# EAGLE design RPi-WD-Packet-Interface - 9pinDSub (EAGLE 7.3.0)
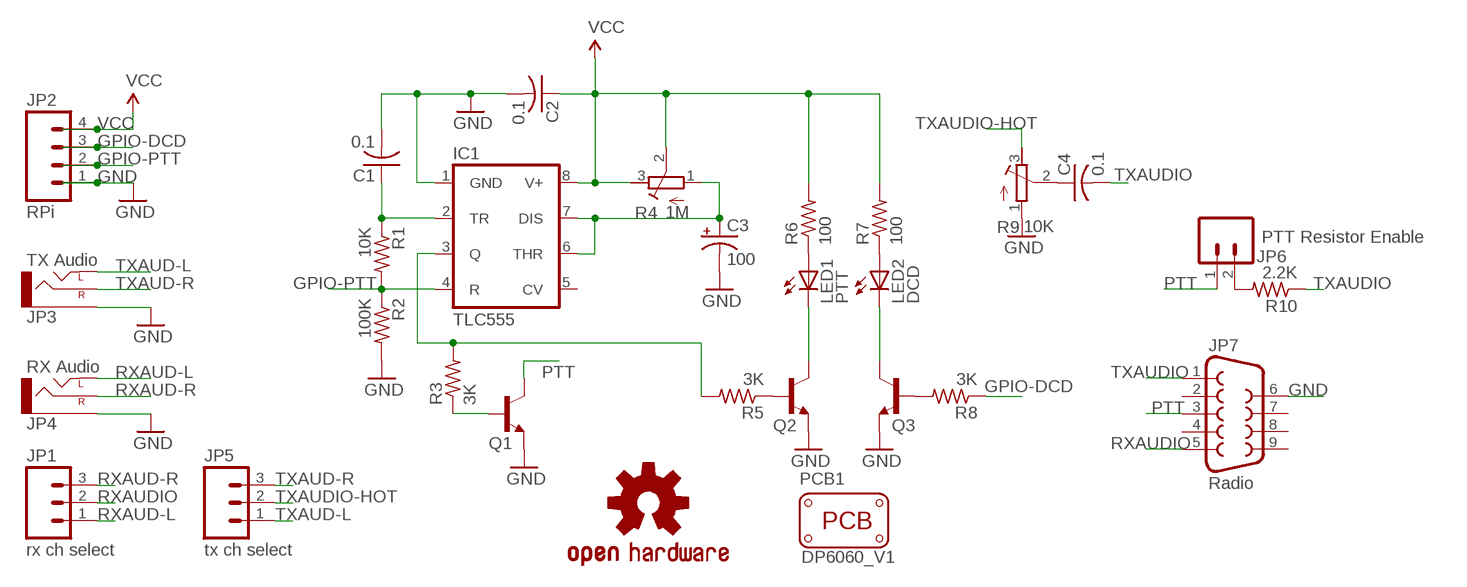
[diagram p0: schematic, sheet 1]

## Parts
C1  0.1  C-US025-025X050  [C025-025X050]
C2  0.1  C-US025-025X050  [C025-025X050]
C3  100  CPOL-USE2-5  [E2-5]
C4  0.1  C-US025-025X050  [C025-025X050]
IC1  TLC555  LM555N  [DIL08]
JP1  rx ch select  M03PTH  [1X03]
JP2  RPi  M04PTH  [1X04]
JP3  TX Audio  AUDIO-JACKPTH  [AUDIO-JACK]
JP4  RX Audio  AUDIO-JACKPTH  [AUDIO-JACK]
JP5  tx ch select  M03PTH  [1X03]
JP6  PTT Resistor Enable  M02PTH  [1X02]
JP7  Radio  DB9FEMALE  [DB9]
LED1  PTT  LED5MM  [LED5MM]
LED2  DCD  LED5MM  [LED5MM]
LOGO1  OSHW-LOGOM  [OSHW-LOGO-M]
PCB1  PCB_DP_SQUARE-6X6  [DP6060_V1]
Q1  PTT  TRANSISTOR_NPNTO-92-AMMO  [TO-92-AMMO]
Q2  PTT-LED  TRANSISTOR_NPNTO-92-AMMO  [TO-92-AMMO]
Q3  DCD-LED  TRANSISTOR_NPNTO-92-AMMO  [TO-92-AMMO]
R1  10K  R-US_0207/7  [0207/7]
R2  100K  R-US_0207/7  [0207/7]
R3  3K  R-US_0207/7  [0207/7]
R4  1M  R-TRIMM3296W  [RTRIM3296W]
R5  3K  R-US_0207/7  [0207/7]
R6  100  R-US_0207/7  [0207/7]
R7  100  R-US_0207/7  [0207/7]
R8  3K  R-US_0207/7  [0207/7]
R9  10K  RTRIM-3362P  [RTRIM3362P]
R10  2.2K  R-US_0207/7  [0207/7]

## Nets
GND: C1.2 C2.2 C3.- IC1.1(GND) JP2.1 JP3.SLEEVE JP4.SLEEVE JP7.6 Q1.1(E) Q2.1(E) Q3.1(E) R2.2 R9.1
GPIO-DCD: JP2.3 R8.1
GPIO-PTT: IC1.4(R) JP2.2 R1.2 R2.1
N$1: LED1.A R6.1
N$2: LED2.A R7.1
N$3: C1.1 IC1.2(TR) R1.1
N$4: C4.1 R9.2
N$5: C3.+ IC1.6(THR) IC1.7(DIS) R4.1(A)
N$6: LED1.K(C) Q2.3(C)
N$7: Q2.2(B) R5.1
N$8: Q1.2(B) R3.1
N$9: LED2.K(C) Q3.3(C)
N$10: Q3.2(B) R8.2
N$11: JP6.2 R10.2
PTT: JP6.1 JP7.3 Q1.3(C)
PTT_TRIGGER: IC1.3(Q) R3.2 R5.2
RXAUD-L: JP1.1 JP4.TIP(LEFT)
RXAUD-R: JP1.3 JP4.RING(RIGHT)
RXAUDIO: JP1.2 JP7.5
TXAUD-L: JP3.TIP(LEFT) JP5.1
TXAUD-R: JP3.RING(RIGHT) JP5.3
TXAUDIO: C4.2 JP7.1 R10.1
TXAUDIO-HOT: JP5.2 R9.3
VCC: C2.1 IC1.8(V+) JP2.4 R4.2(S) R4.3(E) R6.2 R7.2
Unconnected: IC1.5(CV) JP7.2 JP7.4 JP7.7 JP7.8 JP7.9

## Library data of the parts
C1 C2 C4 = rcl:C-US: CAPACITOR, American symbol
C3 = rcl:CPOL-US: POLARIZED CAPACITOR, American symbol
IC1 = linear:*555: TIMER
JP1 JP5 = SparkFun-Connectors:M03: Header 3 Standard 3-pin 0.1" header. Use with straight break away headers (SKU : PRT-00116), right angle break away headers (PRT-00553), swiss pins (PRT-00743), machine pins (PRT-00117), and female headers (PRT-00115). Molex polarized connector foot print use with SKU : PRT-08232 with associated crimp pins and housings.
JP2 = SparkFun-Connectors:M04: Header 4 Standard 4-pin 0.1" header. Use with straight break away headers (SKU : PRT-00116), right angle break away headers (PRT-00553), swiss pins (PRT-00743), machine pins (PRT-00117), and female headers (PRT-00115). Molex polarized connector foot print use with SKU : PRT-08231 with associated crimp pins and housings. 1MM SMD Version SKU: PRT-10208
JP3 JP4 = SparkFun-Connectors:AUDIO-JACK: 3.5mm Audio Jack Simple 3.5mm common PCB mount audio jack. Variant PTH is our storefront SKU PRT-08032
JP6 = SparkFun-Connectors:M02: Standard 2-pin 0.1" header. Use with - straight break away headers ( PRT-00116) - right angle break away headers (PRT-00553) - swiss pins (PRT-00743) - machine pins (PRT-00117) - female headers (PRT-00115) Molex polarized connector foot print use with: PRT-08233 with associated crimp pins and housings. 2.54_SCREWTERM for use with PRT-10571. 3.5mm Screw Terminal footprints for PRT-08084 5mm Screw Terminal footprints for use with PRT-08432
JP7 = SparkFun-Connectors:DB9: DB9 Connector Standard DB9 (D-Sub 9) serial connector. Can be used for CAN bus as well as RS485 and RS232. Footprint production proven. Spark Fun Electronics SKU : PRT-00429; PROD_ID: CONN-08194
LED1 LED2 = led:LED: LED OSRAM: - CHIPLED LG R971, LG N971, LY N971, LG Q971, LY Q971, LO R971, LY R971 LH N974, LH R974 LS Q976, LO Q976, LY Q976 LO Q996 - Hyper CHIPLED LW Q18S LB Q993, LB Q99A, LB R99A - SideLED LS A670, LO A670, LY A670, LG A670, LP A670 LB A673, LV A673, LT A673, LW A673 LH A674 LY A675 LS A676, LA A676, LO A676, LY A676, LW A676 LS A679, LY A679, LG A679 - Hyper Micro SIDELED® LS Y876, LA Y876, LO Y876, LY Y876 LT Y87S - SmartLED LW L88C, LW L88S LB L89C, LB L89S, LG L890 LS L89K, LO L89K, LY L89K LS L896, LA L896, LO L896, LY L896 - TOPLED LS T670, LO T670, LY T670, LG T670, LP T670 LSG T670, LSP T670, LSY T670, LOP T670, LYG T670 LG T671, LOG T671, LSG T671 LB T673, LV T673, LT T673, LW T673 LH T674 LS T676, LA T676, LO T676, LY T676, LB T676, LH T676, LSB T676, LW T676 LB T67C, LV T67C, LT T67C, LS T67K, LO T67K, LY T67K, LW E67C LS E67B, LA E67B, LO E67B, LY E67B, LB E67C, LV E67C, LT E67C LW T67C LS T679, LY T679, LG T679 LS T770, LO T770, LY T770, LG T770, LP T770 LB T773, LV T773, LT T773, LW T773 LH T774 LS E675, LA E675, LY E675, LS T675 LS T776, LA T776, LO T776, LY T776, LB T776 LHGB T686 LT T68C, LB T68C - Hyper Mini TOPLED® LB M676 - Mini TOPLED Santana® LG M470 LS M47K, LO M47K, LY M47K Source: http://www.osram.convergy.de LUXEON: - LUMILED® LXK2-PW12-R00, LXK2-PW12-S00, LXK2-PW14-U00, LXK2-PW14-V00 LXK2-PM12-R00, LXK2-PM12-S00, LXK2-PM14-U00 LXK2-PE12-Q00, LXK2-PE12-R00, LXK2-PE12-S00, LXK2-PE14-T00, LXK2-PE14-U00 LXK2-PB12-K00, LXK2-PB12-L00, LXK2-PB12-M00, LXK2-PB14-N00, LXK2-PB14-P00, LXK2-PB14-Q00 LXK2-PR12-L00, LXK2-PR12-M00, LXK2-PR14-Q00, LXK2-PR14-R00 LXK2-PD12-Q00, LXK2-PD12-R00, LXK2-PD12-S00 LXK2-PH12-R00, LXK2-PH12-S00 LXK2-PL12-P00, LXK2-PL12-Q00, LXK2-PL12-R00 Source: www.luxeon.com KINGBRIGHT: KA-3528ASYC Source: www.kingbright.com
LOGO1 = SparkFun-Aesthetics:OSHW-LOGO: Open Source Hardware Logo This logo indicates the piece of hardware it is found on incorporates a OSHW license and/or adheres to the definition of open source hardware found here: http://freedomdefined.org/OSHW
PCB1 = dp_devices:PCB_DP_SQUARE: Dangerous Prototypes Standard Square PCB sizes; PCB_SIZE: DP6060_V1
Q1-Q3 = SparkFun-DiscreteSemi:TRANSISTOR_NPN: Generic NPN BJT MMBT2222A - TRANS-08049 (SOT-23, 1A 40V) MPSA42 - TRANS-09116 (SOT-23, 500mA 300V) MMBT5088LT1G - TRANS-11160 (SOT-23, 50 mA 30V) BC547 - COM-08928 <http://www.sparkfun.com/products/8928> (TO-92 45V 100mA) (1.Collector 2.Base 3.Emitter) 2N3904 - COM-00521 <http://www.sparkfun.com/products/521> (TO-92 40V 200mA) (1.Emitter 2.Base 3.Collector) P2N2222A - COM-12852 <http://www.sparkfun.com/products/12852> (TO-92 40V 600mA) (1.Collector 2.Base 3.Emitter)
R1-R3 R5-R8 R10 = rcl:R-US_: RESISTOR, American symbol
R4 = rcl:R-TRIMM: Trimm resistor
R9 = GeekAmmo:RTRIM: BOURNS 3362 - 1/4" Square Trimpot® Trimming Potentiometer

## Net classes
0 default: width 0.61 mm, clearance 0.254 mm

## Board
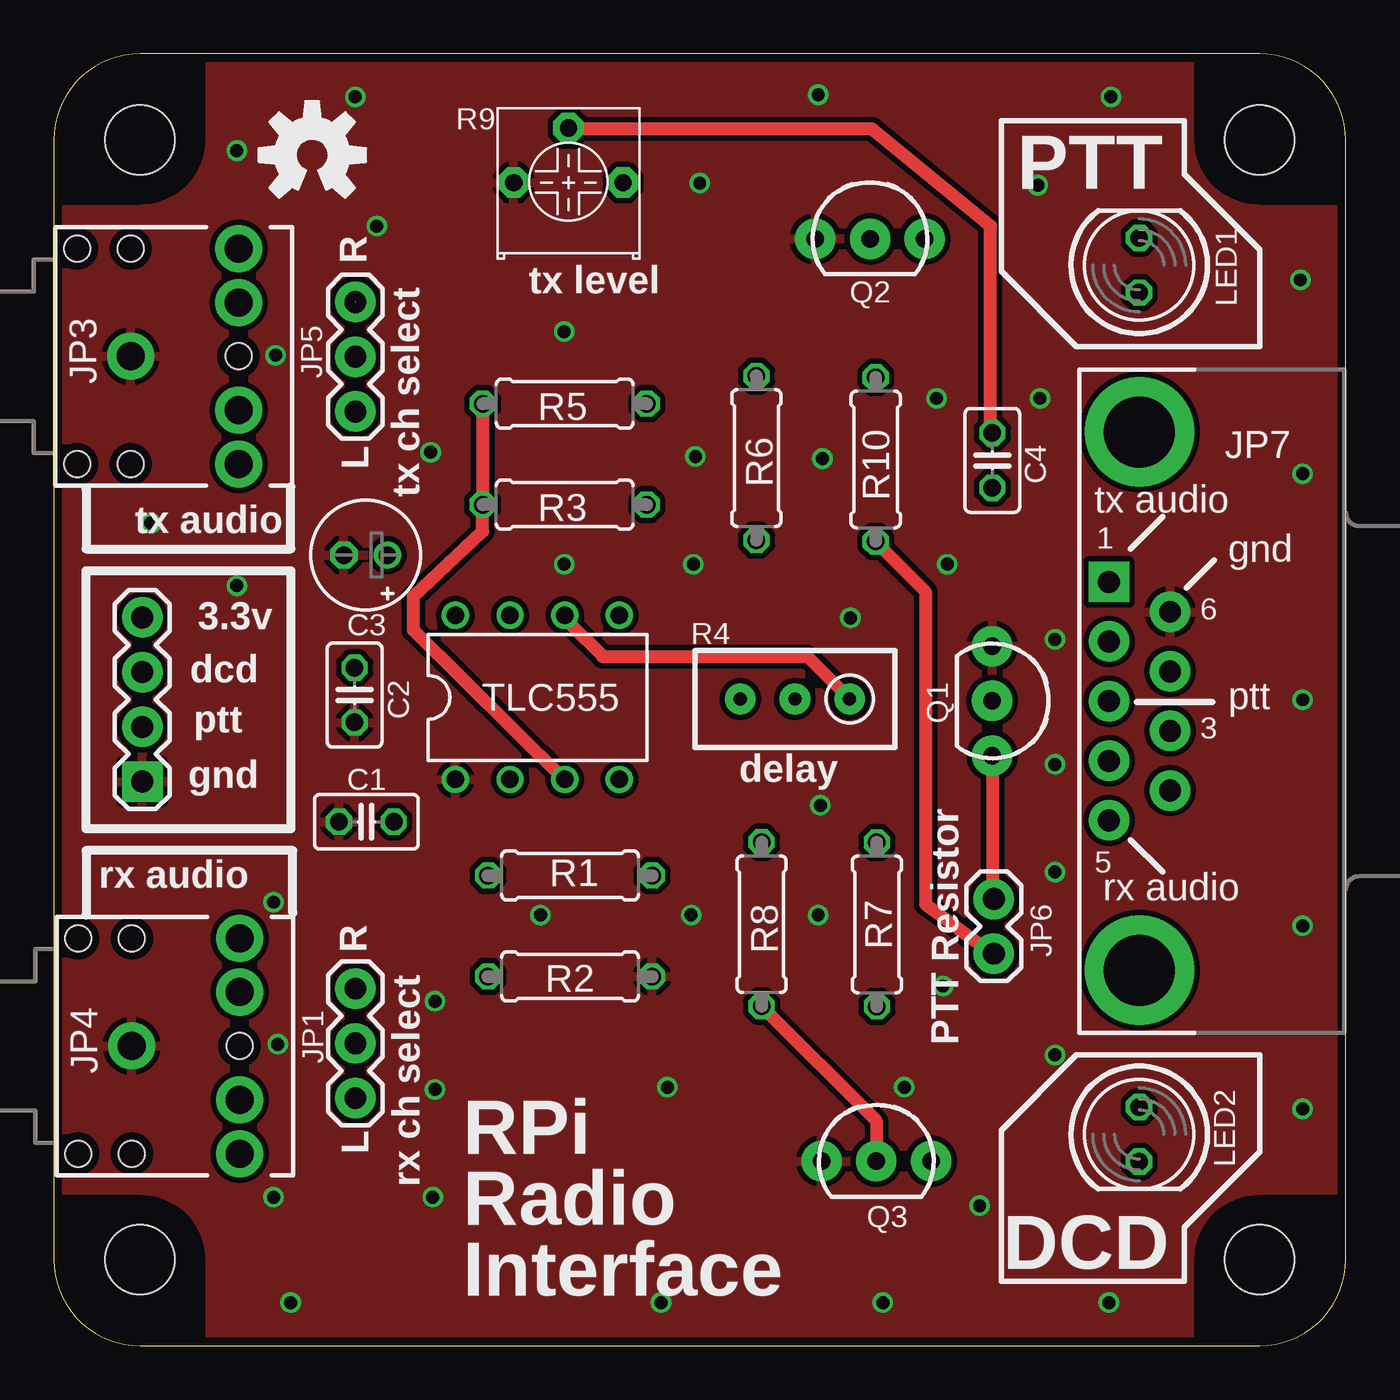
[diagram p1: board, top side]
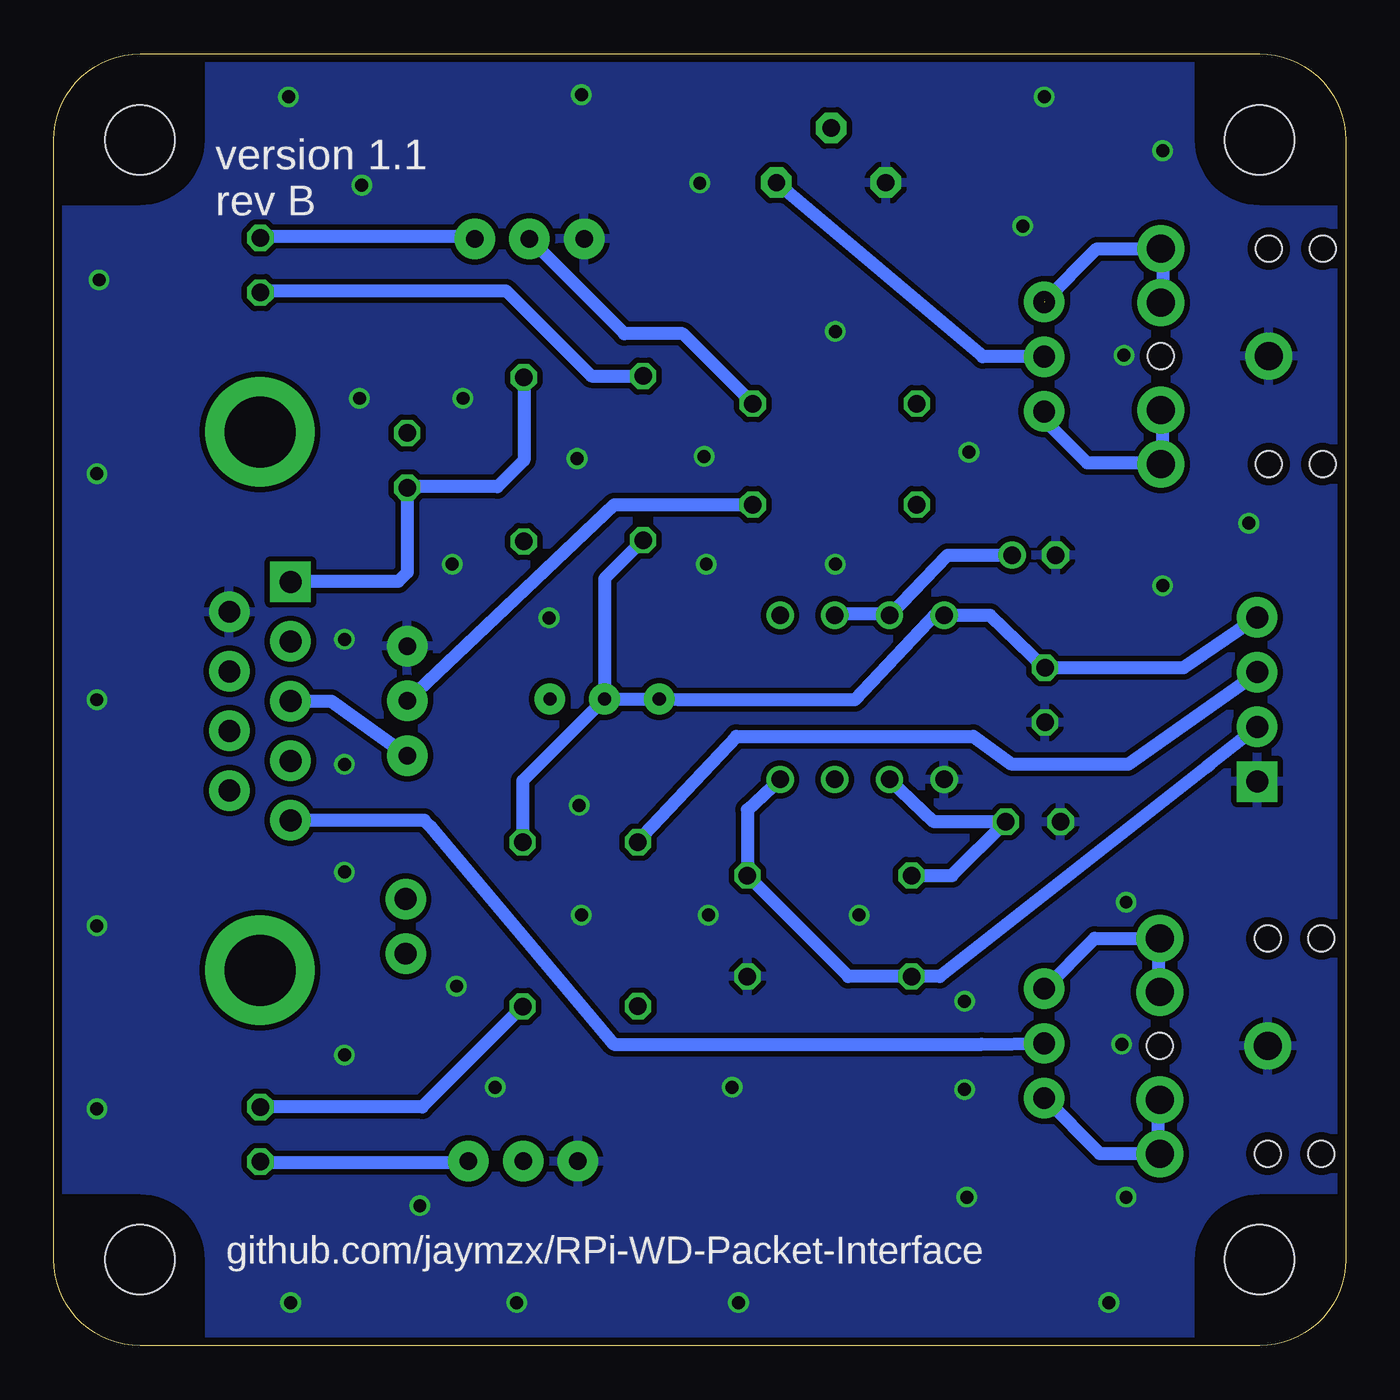
[diagram p2: board, bottom side, seen from below]

Size 60 x 60 mm. Coordinates in mm from the lower left corner, seen from the top.
Copper layers (1*16): Top 0.0356mm / dielectric 1.5011mm / Bottom 0.0356mm
Design rules "OSHParkDesignRules *": minimum track width 6mil, minimum drill 13mil, track to track 6mil, track to pad 6mil, pad to pad 6mil, via to via 6mil, smd to smd 6mil, copper to edge 15mil, drill to drill 6mil, minimum pad ring 7mil, minimum via ring 7mil, stop-mask expansion 3mil, vias tented up to drill 25mm, thermal gap 10mil

### Footprints (pad centres in the part's own frame; a part is rotated, then mirrored left to right if it is on the bottom)
C025-025X050 = drill 0.813 octagon: 1 -1.27,0; 2 1.27,0
E2-5 = drill 0.813 pad 1.27: + -1.016,0 | drill 0.813 pad 1.27 octagon: - 1.016,0
DIL08 = drill 0.813 pad 1.27: 1 -3.81,-3.81; 2 -1.27,-3.81; 3 1.27,-3.81; 4 3.81,-3.81; 5 3.81,3.81; 6 1.27,3.81; 7 -1.27,3.81; 8 -3.81,3.81
1X03 = drill 1.016 pad 1.88: 1 0,0; 2 2.54,0; 3 5.08,0
1X04 = drill 1.016 pad 1.88 square: 1 0,0 | drill 1.016 pad 1.88: 2 2.54,0; 3 5.08,0; 4 7.62,0
AUDIO-JACK = drill 1.3 pad 2.184: RING 5,5; RSH 5,2.5; SLEEVE 0,0; TIP 5,-5; TSH 5,-2.5 | hole 1.2: 0,5; -2.5,5; -2.5,-5; 0,-5; 5,0
1X02 = drill 1.016 pad 1.88: 1 0,0; 2 2.54,0
DB9 = drill 1.016 pad 1.88 square: 1 -5.54,-1.42 | drill 1.016 pad 1.88: 2 -2.77,-1.42; 3 0,-1.42; 4 2.77,-1.42; 5 5.54,-1.42; 6 -4.15,1.42; 7 -1.38,1.42; 8 1.38,1.42; 9 4.15,1.42 | drill 3.302 pad 5.08: G1 -12.5,0; G2 12.5,0
LED5MM = drill 0.813 octagon: A -1.27,0; K 1.27,0
DP6060_V1 = hole 3.2: -26,-26; 26,-26; 26,26; -26,26
TO-92-AMMO = drill 0.813 pad 1.88: 1 -2.54,0; 2 0,0; 3 2.54,0
0207/7 = drill 0.813 octagon: 1 -3.81,0; 2 3.81,0
RTRIM3296W = drill 0.61 pad 1.422: 1 0,-2.54; 2 0,0; 3 0,2.54
RTRIM3362P = drill 0.8 pad 1.422 octagon: 1 -2.54,-2.54; 2 0,0; 3 2.54,-2.54

### Placement (x,y rotation side)
C1  14.52,24.33 180 top
C2  13.97,30.21 270 top
C3  14.48,36.72 180 top
C4  43.59,41.12 270 top
IC1  22.46,30.11 0 top
JP1  14.01,11.5 90 top
JP2  4.11,26.2 90 top
JP3  3.58,45.95 0 top
JP4  3.62,13.92 0 top
JP5  14.01,43.39 90 top
JP6  43.66,20.75 270 top
JP7  50.42,29.93 270 top
LED1  50.41,50.18 90 top
LED2  50.41,9.81 270 top
LOGO1  12,55.3 0 top
PCB1  30,30 0 top
Q1  43.59,29.95 270 top
Q2  37.91,51.41 0 top
Q3  38.2,8.57 0 top
R1  23.98,21.84 0 top
R2  23.98,17.15 0 top
R3  23.73,39.06 180 top
R4  34.42,30.04 90 top
R5  23.73,43.75 180 top
R6  32.63,41.23 270 top
R7  38.23,19.57 90 top
R8  32.87,19.57 270 top
R9  23.9,56.56 0 top
R10  38.17,41.16 270 top

### Tracks (layer width: path | path; a pad name or v marks a point on that pad's centre or on a via)
GND  (via drill 0.6 pad 0.25)
  other vias: 49.1,58 45.7,53.9 35.5,58.1 17.6,6.9 14,58 8.5,55.5 15,52 30,54 57.9,49.5 41,44 17.5,41.5 4.5,38.2 10.3,46 58,40.5 45.8,44 8.5,35.3 46.5,22 58,19.5 35.5,20 41.3,16.7 10.4,14 17.7,11.9 28.5,12 58,11 43,6.5 49,2 38.5,2 28.2,2 11,2 39.5,12 46.5,13.5 58,30 17.7,16 29.6,20 23.7,36.3 35.7,41.2 29.8,41.3 35.6,25.1 23.7,47.1 10.2,20.6 10.2,6.9 22.6,20 41.5,36.3 37,33.8 46.5,27 46.5,32.8 29.7,36.3
  pour Top (isolate 0.012): 0,60 60,60 60,0 0,0
  pour Bottom (isolate 0.012): 0,60 60,60 60,0 0,0
GPIO-DCD
  Bottom 0.61: R8.1 33,23.3 28.3,28.3 17.3,28.3 15.5,27 10.1,27 4.72,30.78 JP2.3
GPIO-PTT
  Bottom 0.61: IC1.4 27.79,24.89 R1.2 23.09,17.15 R2.1 18.85,17.15 6.3,27 6.45,26.9 JP2.2
N$1
  Bottom 0.61: LED1.A 50.32,49 39,49 35.03,45.03 R6.1
N$2
  Bottom 0.61: R7.1 42.9,11.09 LED2.A
N$3
  Bottom 0.61: IC1.2 19.12,24.33 C1.1 18.28,21.84 R1.1
N$4
  Top 0.61: R9.2 24,56.5 38,56.5 43.5,52 43.5,42 C4.1
N$5
  Top 0.61: R4.1 36.5,30.5 35,32 25.5,32 24,33.5 IC1.6
  Bottom 0.254: 21.5,34 IC1.7 | 23.5,34 IC1.6
  Bottom 0.61: 23.5,34 21.5,34 | IC1.7 18.49,36.72 C3.+
N$6
  Bottom 0.254: 40.5,51.5 Q2.3
  Bottom 0.61: 40.5,51.5 50,51.5 LED1.K
N$7
  Bottom 0.61: R5.1 30.79,47 33.5,47 Q2.2
N$8
  Bottom 0.61: R3.1 33.97,39.06 Q1.2
N$9
  Bottom 0.61: LED2.K 50,8.5 41,8.5 Q3.3
N$10
  Top 0.61: R8.2 38.2,10.44 Q3.2
N$11
  Top 0.61: R10.2 40.5,35 40.5,20.5 42.5,19 JP6.2
N$12
  Bottom 0.61: 8.7,19 8.7,16
N$13
  Bottom 0.61: 8.7,9 8.7,11.5
N$14
  Bottom 0.61: 8.5,51 8.5,48.5
N$15
  Bottom 0.61: 8.5,41 8.5,43.5
PTT
  Top 0.254: 43.59,20.82 JP6.1
  Top 0.61: Q1.3 43.59,20.82
  Bottom 0.61: JP7.3 47.12,29.93 Q1.3
PTT_TRIGGER
  Top 0.61: R5.2 R3.2 19.91,37.81 16.7,34.8 16.7,33.23 IC1.3
RXAUD-L
  Bottom 0.61: JP4.TIP 11.43,8.92 JP1.1
RXAUD-R
  Bottom 0.61: JP1.3 11.66,18.92 JP4.RING
RXAUDIO
  Bottom 0.61: JP1.2 16.9,14 34,14 42.5,24.1 42.8,24.4 JP7.5
TXAUD-L
  Bottom 0.61: JP5.1 14,43 12,41 9,41 JP3.TIP
TXAUD-R  (1 unrouted)
  Bottom 0.61: 14,48.5 11.55,50.95 JP3.RING
TXAUDIO
  Bottom 0.61: R10.1 38.17,41.13 39.4,39.9 43.53,39.9 C4.2 43.59,35.91 44,35.5 48.98,35.5 JP7.1
TXAUDIO-HOT
  Bottom 0.61: JP5.2 16.85,45.93 R9.3
VCC
  Bottom 0.254: 19,34 IC1.8
  Bottom 0.61: 19.1,33.8 IC1.8 16.5,33.92 C2.1 7.54,31.48 JP2.4 | 19,34 22.8,30 31,30 R4.3 R4.2 | R4.2 38.23,26.23 R7.2 | R6.2 34.42,35.62 R4.2

### Text on the board
tPlace: R | tx level | L | tx audio | tx audio | 1 | gnd | 3.3v | 6 | dcd | ptt | ptt | 3 | gnd | delay | 5 | rx audio | rx audio | PTT Resistor | R | L | RPi / Radio / Interface
bPlace: version 1.1 / rev B | github.com/jaymzx/RPi-WD-Packet-Interface